# EAGLE design bump (EAGLE 6.5.0)
AUTHOR: Pat Pannuto; REV: A; TITLE: Bump
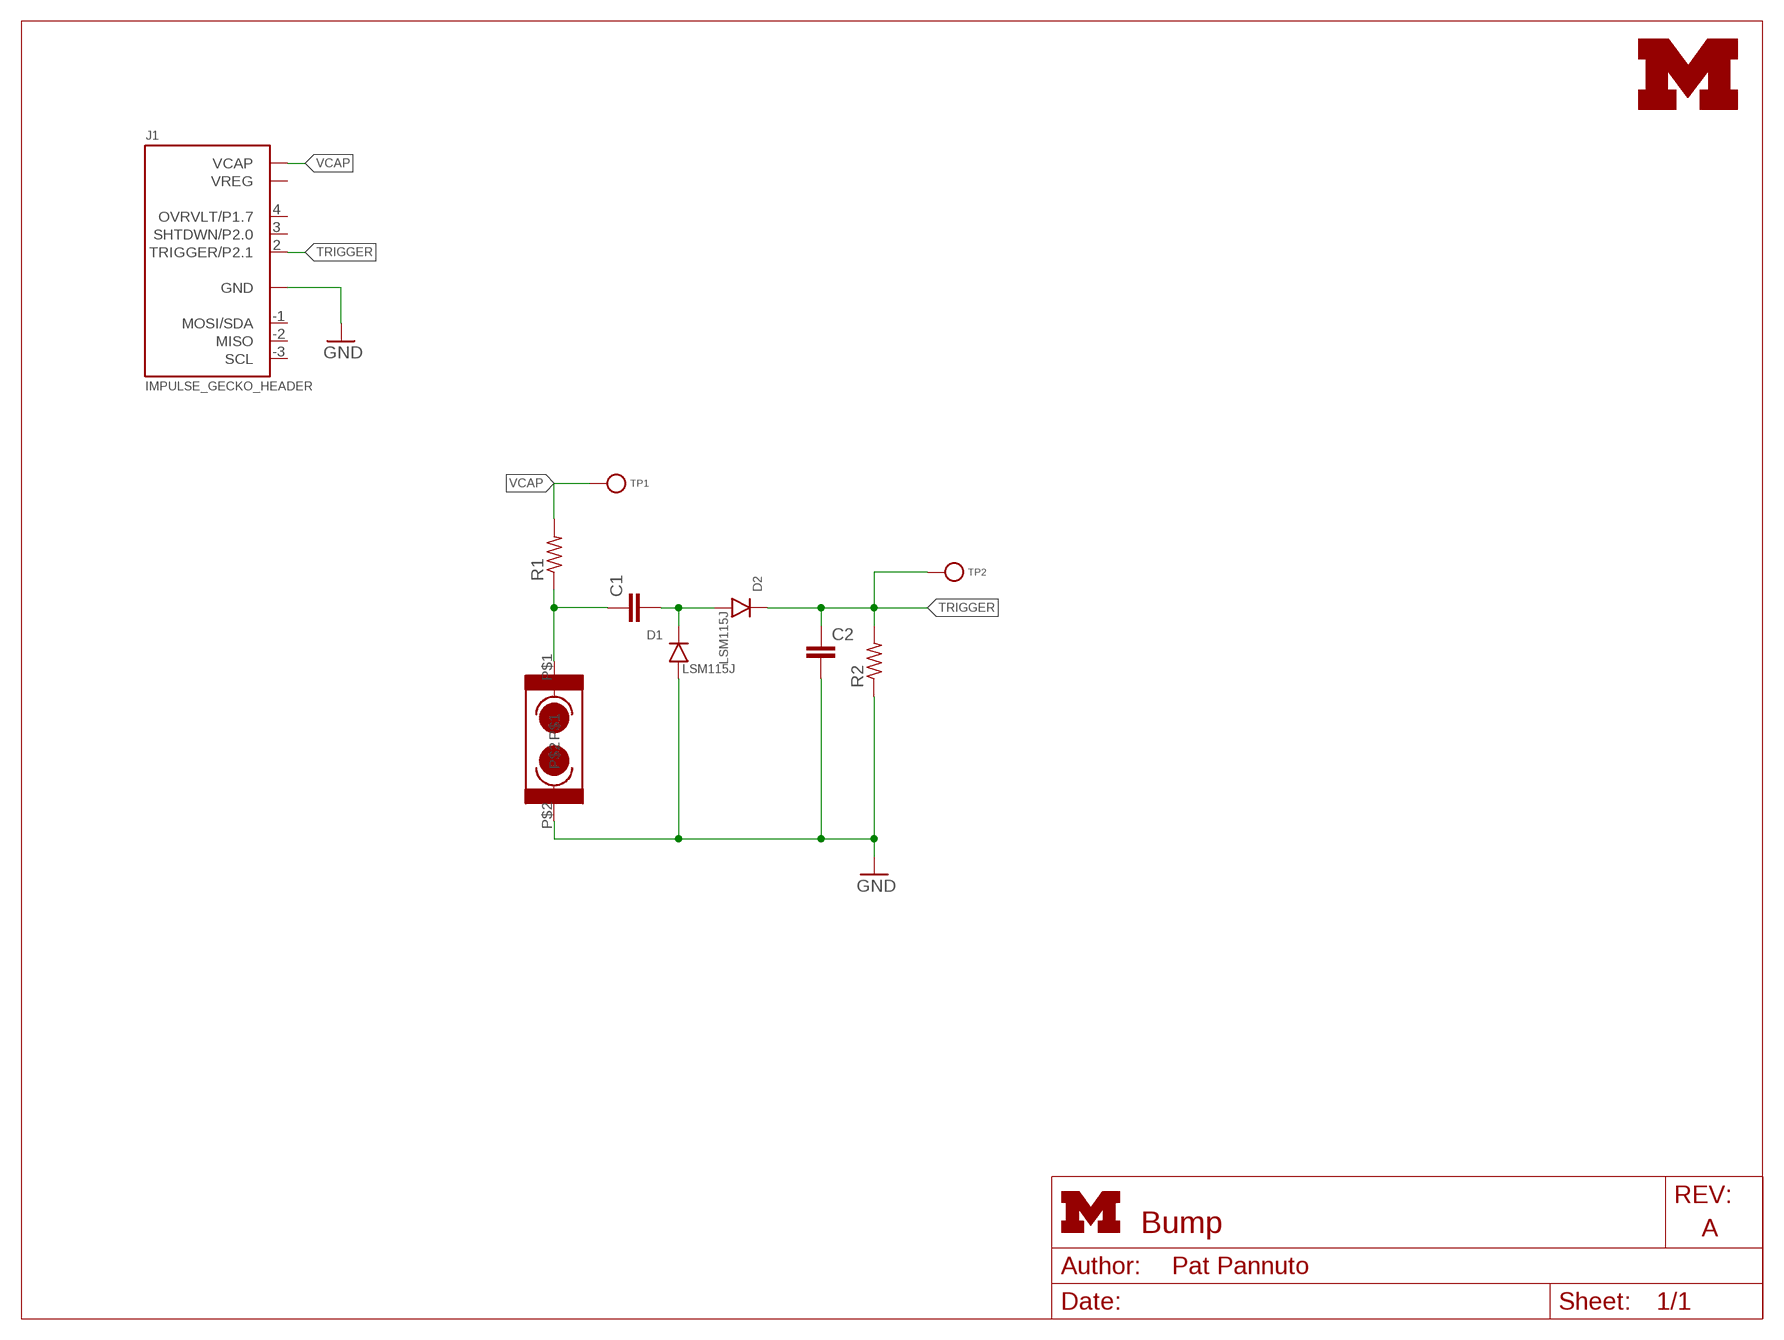
[diagram p0: schematic, sheet 1]
FRAME1 (LETTER_L): HEIGHT: 8.5in; WIDTH: 11in

## Parts
C1  C-EUC0603  [C0603]
C2  C-EUC0603  [C0603]
D1  LSM115J  [D0-214BA]
D2  LSM115J  [D0-214BA]
J1  IMPULSE_GECKO_HEADER  [HEADER1X9/0.05IN]
R1  R-US_R0603  [R0603]
R2  R-US_R0603  [R0603]
TP1  TEST_POINT_0.040IN  [TESTPOINT_0.040IN]
TP2  TEST_POINT_0.040IN  [TESTPOINT_0.040IN]
U$3  UMICH_SOLID_SMALL+  [UMICH_SOLID_100MIL]
VS1  SQ-SEN-200  [SQ-SEN-200]

## Nets
GND: C2.2 D1.A J1.0(GND) R2.1 VS1.P$2
N$1: C1.1 R1.1 VS1.P$1
N$4: C1.2 D1.C D2.A
TRIGGER: C2.1 D2.C J1.2(TRIGGER/P2.1) R2.2 TP2.TESTPOINT
VCAP: J1.5(VCAP) R1.2 TP1.TESTPOINT
Unconnected: J1.1(VREG) J1.3(SHTDWN/P2.0) J1.4(OVRVLT/P1.7) J1.-1(MOSI/SDA) J1.-2(MISO) J1.-3(SCL)

## Library data of the parts
C1 C2 = resistor:C-EU: CAPACITOR, European symbol
D1 D2 = activator:LSM115J: Diode Schottky 15V 1A; DIGIKEY: LSM115JE3/TR13CT-ND
J1 = gecko:IMPULSE_GECKO_HEADER: Header on the impulse EPIC-esque board.
R1 R2 = resistor:R-US_: RESISTOR, American symbol
TP1 TP2 = headers:TEST_POINT_0.040IN: 0.040in Test Point; DIGIKEY: 5001K-ND
U$3 = logos:UMICH_SOLID
VS1 = epic:SQ-SEN-200

## Board
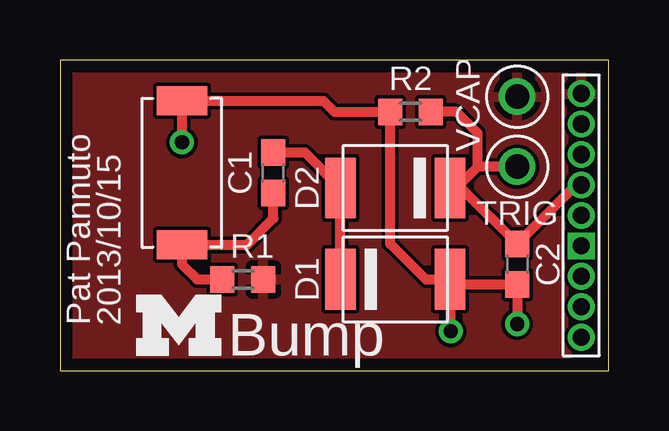
[diagram p1: board, top side]
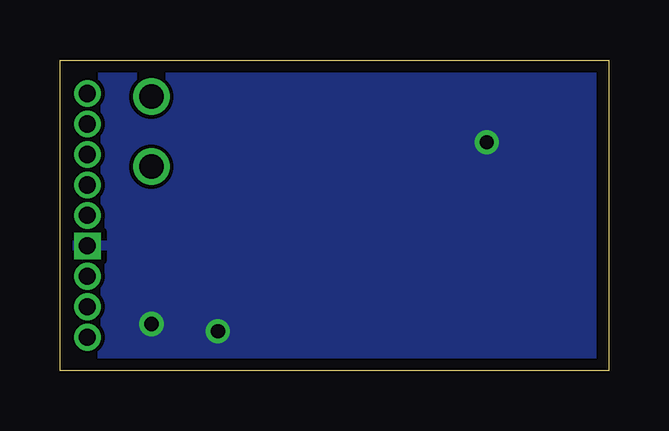
[diagram p2: board, bottom side, seen from below]

Size 22.86 x 12.95 mm. Coordinates in mm from the lower left corner, seen from the top.
Outline: 0,0 22.86,0 22.86,12.95 0,12.95 0,0
Copper layers (1*16): Top 0.0178mm / dielectric 59mil / Bottom 0.0178mm
Design rules "sunstone-2lyr_v1.0.0.3 *": minimum track width 6mil, minimum drill 14mil, track to track 6mil, track to pad 6mil, pad to pad 6mil, via to via 6mil, smd to smd 6mil, copper to edge 20mil, drill to drill 16mil, minimum pad ring 8mil, minimum via ring 8mil, stop-mask expansion 3mil, vias tented up to drill 24mil, thermal gap 10mil

### Footprints (pad centres in the part's own frame; a part is rotated, then mirrored left to right if it is on the bottom)
C0603 = smd 1.1 x 1: 1 -0.85,0; 2 0.85,0
D0-214BA = smd 1.27 x 2.54: A -2.286,0; C 2.286,0
HEADER1X9/0.05IN = drill 0.711 pad 1.016 square: 0 -1.27,0 | drill 0.711 pad 1.016: 1 0,0; 2 1.27,0; 3 2.54,0; 4 3.81,0; 5 5.08,0; -1 -2.54,0; -2 -3.81,0; -3 -5.08,0
R0603 = smd 1 x 1.1: 1 -0.85,0; 2 0.85,0
TESTPOINT_0.040IN = drill 1.016: TESTPOINT 0,0
SQ-SEN-200 = smd 1.2 x 2.1: P$1 -3,0; P$2 3,0

### Placement (x,y rotation side)
C1  8.89,8.26 90 top
C2  19.05,4.45 270 top
D1  13.97,3.81 180 top
D2  13.97,7.62 0 top
J1  21.72,6.48 90 top
R1  7.62,3.81 0 top
R2  14.61,10.79 0 top
TP1  19.05,11.43 0 top
TP2  19.05,8.51 0 top
U$3  3.17,0.64 0 top
VS1  5.08,8.26 90 top

### Tracks (layer width: path | path; a pad name or v marks a point on that pad's centre or on a via)
GND  (via drill 0.6)
  Top 0.406: D1.A 16.47,3.6 C2.2 v19.05,1.96 | D1.A 15.24,3.81 13.76,5.29 R2.1 11.43,10.79 10.97,11.26 VS1.P$2 v5.08,9.53 | D1.A 16.26,1.68
  other vias: 16.28,1.65
  pour Bottom: -0.64,13.97 -0.64,-1.27 23.5,-1.27 23.5,13.97
N$1
  Top 0.406: R1.1 5.71,3.81 5.08,4.45 VS1.P$1 7.79,5.25 8.89,6.35 C1.1
N$4
  Top 0.406: D1.C D2.A 10.2,9.11 C1.2
TRIGGER
  Top 0.406: J1.2 21.5,7.75 C2.1 16.73,7.62 16.51,7.62 | D2.C 16.51,7.62 | TP2.TESTPOINT 17.4,8.51 | 17.4,8.51 16.51,7.62 | 17.4,8.51 17.4,9.91 16.51,10.79 R2.2
VCAP
  pour Top: -1.27,15.24 -1.27,-2.54 24.13,-2.54 24.13,15.24

### Text on the board
tPlace: VCAP | TRIG | Pat Pannuto | 2013/10/15 | Bump